# Altium schematic sheet rs485.SchDoc
size A4; Organization: 合肥弗雷电子; Address1: 玉兰大道14号D栋3楼; Address2: 肥西县桃花镇; Address3: 合肥市; Address4: 安徽省
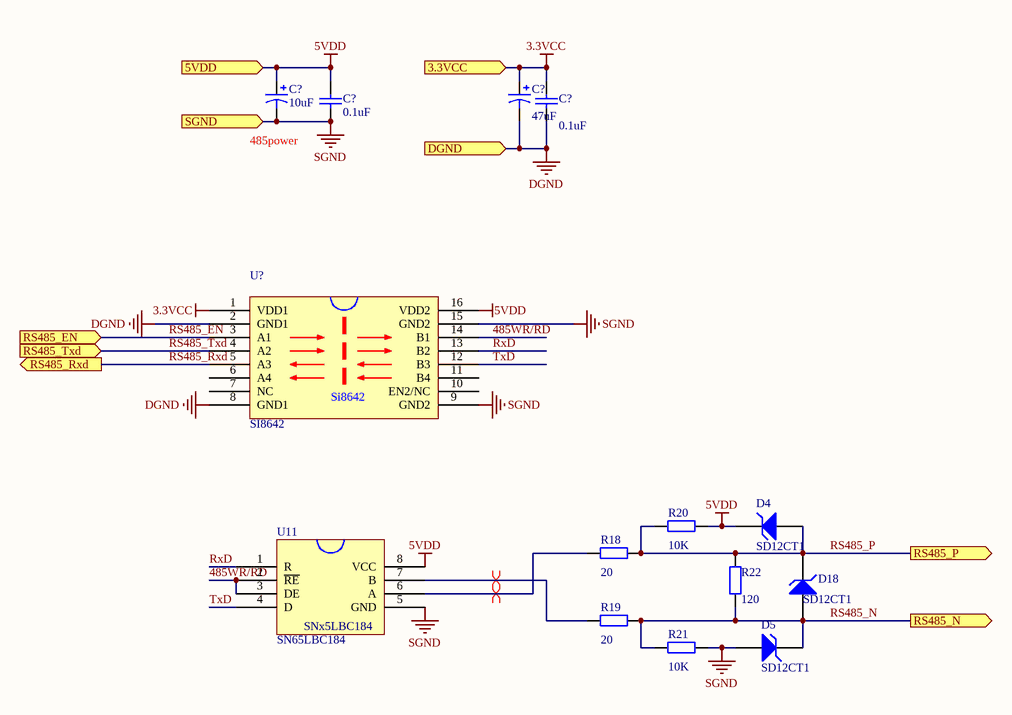
[diagram p0: rs485.SchDoc]

## Parts
(Parts that share a designator on the sheet are numbered #1, #2 ... from top to bottom, then left to right.)
C?#1  value 10uF  [CB]  (hidden comment: T494B106M006AHAUTO)
C?#2  value 47uF  [CB]  (hidden comment: T494B476M010AHAUTO)
C?#3  value 0.1uF  [0805c]  (hidden comment: CC0805MRX7R9BB104)
C?#4  value 0.1uF  [0805c]  (hidden comment: CC0805MRX7R9BB104)
D4  SD12CT1  [sod323]
D5  SD12CT1  [sod323]
D18  SD12CT1  [sod323]
R18  value 20  [0805R]  (hidden comment: RC0805JR-0720RL)
R19  value 20  [0805R]  (hidden comment: RC0805JR-0720RL)
R20  value 10K  [0805R]  (hidden comment: RC0805JR-0710KL)
R21  value 10K  [0805R]  (hidden comment: RC0805JR-0710KL)
R22  value 120  [0805R]  (hidden comment: RC0805JR-07120RL)
U11  SN65LBC184  [so-8-n]
U?  SI8642

## Ports
3.3VCC (in), 5VDD (in), DGND (in), RS485_EN (in), RS485_N (out), RS485_P (out), RS485_Rxd (out), RS485_Txd (in), SGND (in)

## Nets
3.3VCC: C?#2.1 C?#3.1 U?.1(VDD1) ; port 3.3VCC
5VDD: C?#1.1 C?#4.2 D4.2(K) R20.1 U11.8(VCC) U?.16(VDD2) ; port 5VDD
DGND: C?#2.2 C?#3.2 U?.2(GND1) U?.8(GND1) ; port DGND
SGND: C?#1.2 C?#4.1 D5.1(A) R21.1 U11.5(GND) U?.9(GND2) U?.15(GND2) ; port SGND
485WR/RD: U11.2(~{RE}) U11.3(DE) U?.14(B1)
RS485_EN: U?.3(A1) ; port RS485_EN
RS485_N: D5.2(K) D18.1(A) R19.1 R21.2 R22.1 ; port RS485_N
RS485_P: D4.1(A) D18.2(K) R18.2 R20.2 R22.2 ; port RS485_P
RS485_Rxd: U?.5(A3) ; port RS485_Rxd
RS485_Txd: U?.4(A2) ; port RS485_Txd
RxD: U11.1(R) U?.13(B2)
TxD: U11.4(D) U?.12(B3)
NetR18_1: R18.1 U11.6(A)
NetR19_2: R19.2 U11.7(B)

Not connected (* = marked no-connect by the designer): U? 6(A4) 7(NC) 10(EN2/NC) 11(B4)

## Layout directives
differential pair: NetR18_1, NetR19_2

## Notes on the sheet
- (near C?#1) 485power
- Title
- Size:
- Date:
- A4
- Number:
- Time:
- Revision:
- Sheet
- of
- File:
- (in symbol SI8642) Si8642

## Library data of the parts
C?#1 C?#2 = Cap Pol1: Polarized Capacitor (Radial); Published: 8-Jun-2000; LatestRevisionDate: 17-Jul-2002; LatestRevisionNote: Re-released for DXP Platform.; PackageReference: RB7.6-15; Publisher: Altium Limited; PackageDescription: Polarized Capacitor (Radial); 2 Leads
C?#3 C?#4 = Cap: Capacitor; Published: 8-Jun-2000; LatestRevisionDate: 17-Jul-2002; LatestRevisionNote: Re-released for DXP Platform.; PackageReference: RAD-0.3; Publisher: Altium Limited; PackageDescription: Radial Cap, Thru-Hole; 2 Leads; 0.3 in Pin Spacing
D4 D5 D18 = D Zener: Zener Diode; Published: 8-Jun-2000; LatestRevisionDate: 17-Jul-2002; LatestRevisionNote: Re-released for DXP Platform.; PackageReference: DIODE-0.7; Publisher: Altium Limited; PackageDescription: Diode, Thru-Hole; 2 Leads; 0.7 in Pin Spacing
R18-R22 = Res2: Resistor; Published: 8-Jun-2000; LatestRevisionDate: 17-Jul-2002; LatestRevisionNote: Re-released for DXP Platform.; PackageReference: AXIAL-0.4; Publisher: Altium Limited; PackageDescription: Axial Device, Thru-Hole; 2 Leads; 0.4 in Pin Spacing
U11 = SNx5LBC184